# EAGLE design PullDownResistorShield (EAGLE 8.5.1)
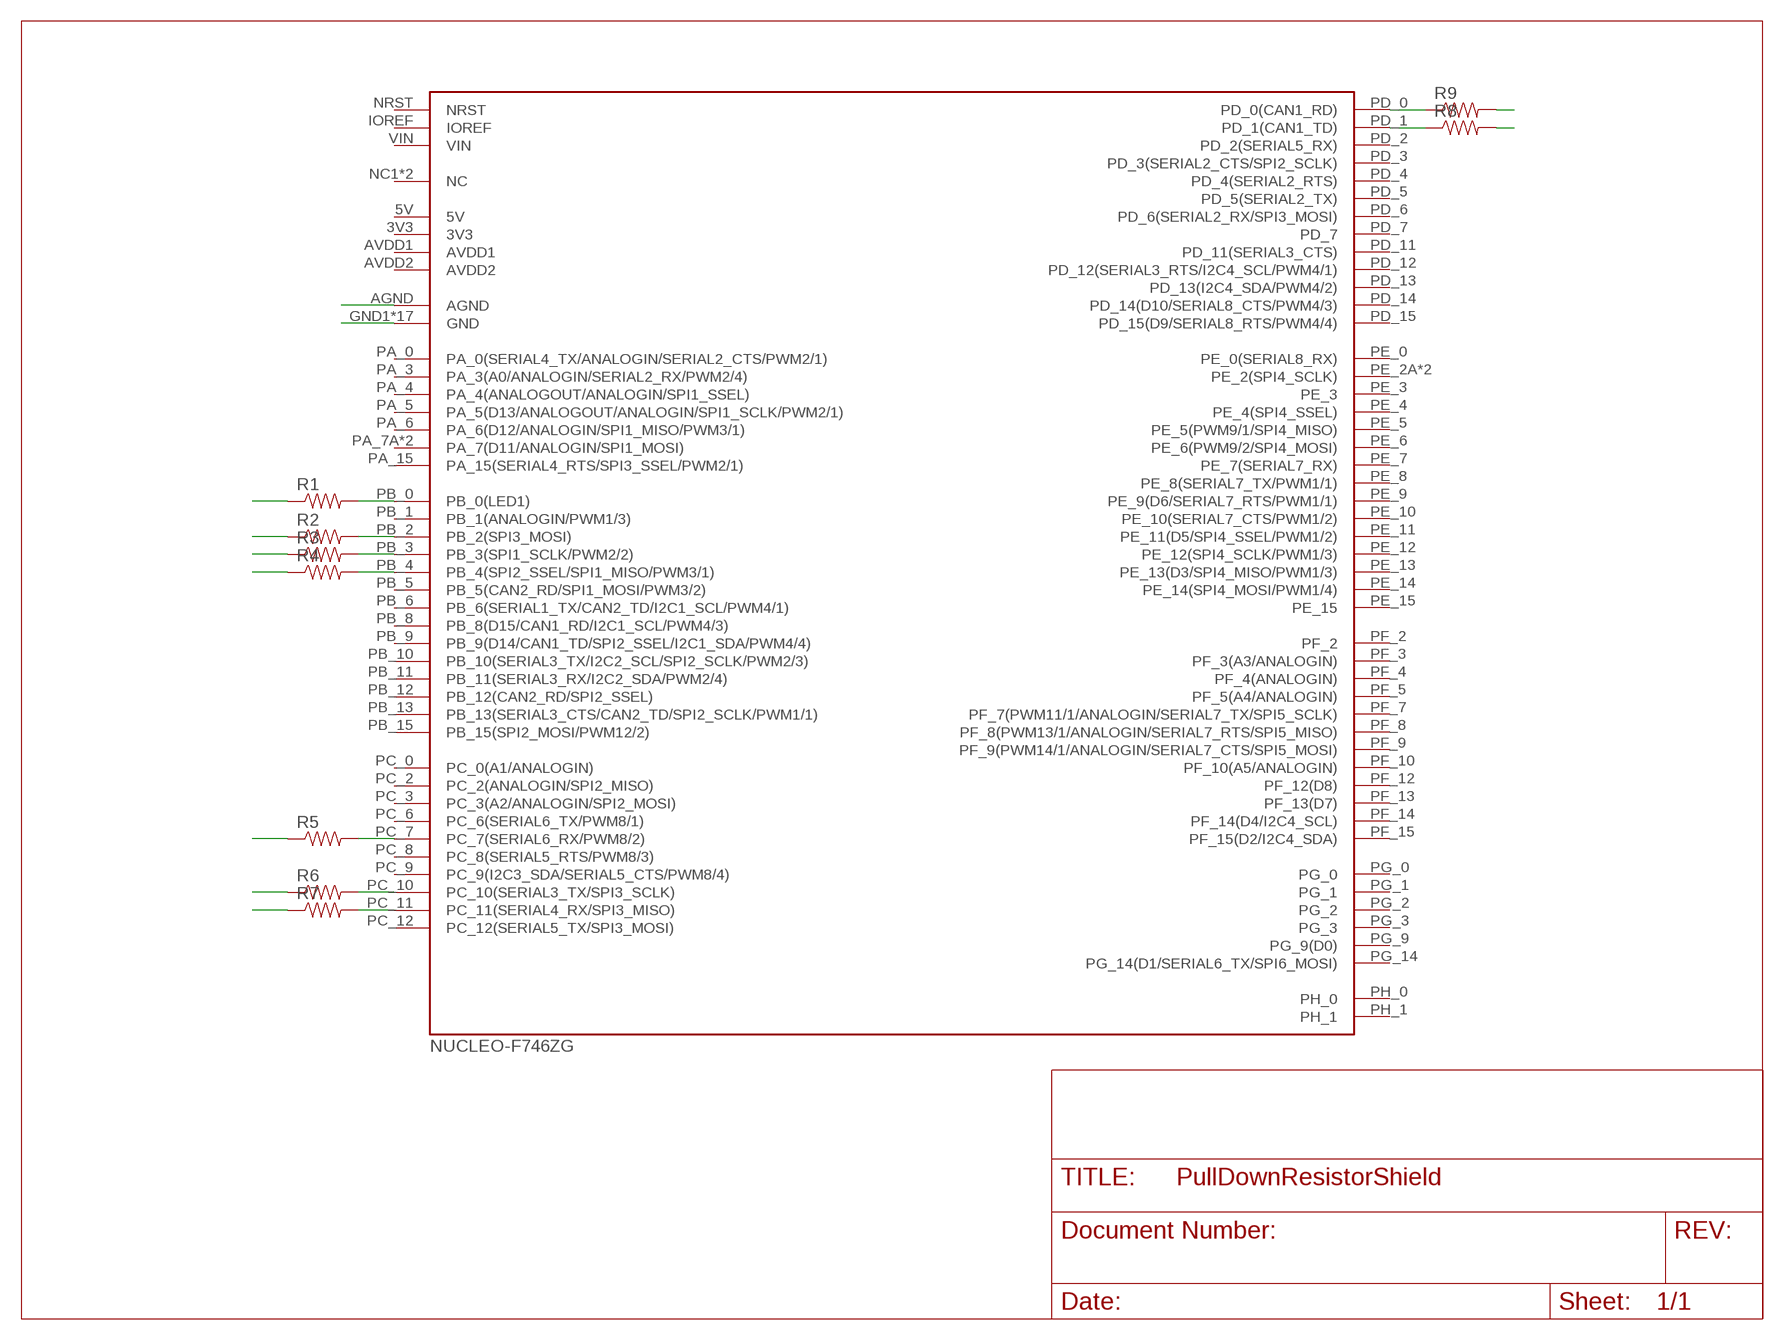
[diagram p0: schematic, sheet 1]

## Parts
R1  RESISTORPTH-1/4W  [AXIAL-0.4]
R2  RESISTORPTH-1/4W  [AXIAL-0.4]
R3  RESISTORPTH-1/4W  [AXIAL-0.4]
R4  RESISTORPTH-1/4W  [AXIAL-0.4]
R5  RESISTORPTH-1/4W  [AXIAL-0.4]
R6  RESISTORPTH-1/4W  [AXIAL-0.4]
R7  RESISTORPTH-1/4W  [AXIAL-0.4]
R8  RESISTORPTH-1/4W  [AXIAL-0.4]
R9  RESISTORPTH-1/4W  [AXIAL-0.4]
U$1  NUCLEO-F746ZGNUCLEO-F746ZG  [NUCLEO-F746ZG]

## Nets
GND: R1.P$1 R2.P$1 R3.P$1 R4.P$1 R5.P$1 R6.P$1 R7.P$1 R8.P$2 R9.P$2 U$1.AGND U$1.GND1(GND) U$1.GND2(GND) U$1.GND3(GND) U$1.GND4(GND) U$1.GND5(GND) U$1.GND6(GND) U$1.GND7(GND) U$1.GND8(GND) U$1.GND9(GND) U$1.GND10(GND) U$1.GND11(GND) U$1.GND12(GND) U$1.GND13(GND) U$1.GND14(GND) U$1.GND15(GND) U$1.GND16(GND) U$1.GND17(GND)
N$1: R1.P$2 U$1.PB_0(PB_0(LED1))
N$2: R2.P$2 U$1.PB_2(PB_2(SPI3_MOSI))
N$3: R3.P$2 U$1.PB_3(PB_3(SPI1_SCLK/PWM2/2))
N$4: R4.P$2 U$1.PB_4(PB_4(SPI2_SSEL/SPI1_MISO/PWM3/1))
N$5: R5.P$2 U$1.PC_7(PC_7(SERIAL6_RX/PWM8/2))
N$6: R6.P$2 U$1.PC_10(PC_10(SERIAL3_TX/SPI3_SCLK))
N$7: R7.P$2 U$1.PC_11(PC_11(SERIAL4_RX/SPI3_MISO))
N$8: R9.P$1 U$1.PD_0(PD_0(CAN1_RD))
N$9: R8.P$1 U$1.PD_1(PD_1(CAN1_TD))
Unconnected: U$1.3V3 U$1.5V U$1.AVDD1 U$1.AVDD2 U$1.IOREF U$1.NC1(NC) U$1.NC2(NC) U$1.NRST U$1.PA_0(PA_0(SERIAL4_TX/ANALOGIN/SERIAL2_CTS/PWM2/1)) U$1.PA_3(PA_3(A0/ANALOGIN/SERIAL2_RX/PWM2/4)) U$1.PA_4(PA_4(ANALOGOUT/ANALOGIN/SPI1_SSEL)) U$1.PA_5(PA_5(D13/ANALOGOUT/ANALOGIN/SPI1_SCLK/PWM2/1)) U$1.PA_6(PA_6(D12/ANALOGIN/SPI1_MISO/PWM3/1)) U$1.PA_7A(PA_7(D11/ANALOGIN/SPI1_MOSI)) U$1.PA_7B(PA_7(D11/ANALOGIN/SPI1_MOSI)) U$1.PA_15(PA_15(SERIAL4_RTS/SPI3_SSEL/PWM2/1)) U$1.PB_1(PB_1(ANALOGIN/PWM1/3)) U$1.PB_5(PB_5(CAN2_RD/SPI1_MOSI/PWM3/2)) U$1.PB_6(PB_6(SERIAL1_TX/CAN2_TD/I2C1_SCL/PWM4/1)) U$1.PB_8(PB_8(D15/CAN1_RD/I2C1_SCL/PWM4/3)) U$1.PB_9(PB_9(D14/CAN1_TD/SPI2_SSEL/I2C1_SDA/PWM4/4)) U$1.PB_10(PB_10(SERIAL3_TX/I2C2_SCL/SPI2_SCLK/PWM2/3)) U$1.PB_11(PB_11(SERIAL3_RX/I2C2_SDA/PWM2/4)) U$1.PB_12(PB_12(CAN2_RD/SPI2_SSEL)) U$1.PB_13(PB_13(SERIAL3_CTS/CAN2_TD/SPI2_SCLK/PWM1/1)) U$1.PB_15(PB_15(SPI2_MOSI/PWM12/2)) U$1.PC_0(PC_0(A1/ANALOGIN)) U$1.PC_2(PC_2(ANALOGIN/SPI2_MISO)) U$1.PC_3(PC_3(A2/ANALOGIN/SPI2_MOSI)) U$1.PC_6(PC_6(SERIAL6_TX/PWM8/1)) U$1.PC_8(PC_8(SERIAL5_RTS/PWM8/3)) U$1.PC_9(PC_9(I2C3_SDA/SERIAL5_CTS/PWM8/4)) U$1.PC_12(PC_12(SERIAL5_TX/SPI3_MOSI)) U$1.PD_2(PD_2(SERIAL5_RX)) U$1.PD_3(PD_3(SERIAL2_CTS/SPI2_SCLK)) U$1.PD_4(PD_4(SERIAL2_RTS)) U$1.PD_5(PD_5(SERIAL2_TX)) U$1.PD_6(PD_6(SERIAL2_RX/SPI3_MOSI)) U$1.PD_7 U$1.PD_11(PD_11(SERIAL3_CTS)) U$1.PD_12(PD_12(SERIAL3_RTS/I2C4_SCL/PWM4/1)) U$1.PD_13(PD_13(I2C4_SDA/PWM4/2)) U$1.PD_14(PD_14(D10/SERIAL8_CTS/PWM4/3)) U$1.PD_15(PD_15(D9/SERIAL8_RTS/PWM4/4)) U$1.PE_0(PE_0(SERIAL8_RX)) U$1.PE_2A(PE_2(SPI4_SCLK)) U$1.PE_2B(PE_2(SPI4_SCLK)) U$1.PE_3 U$1.PE_4(PE_4(SPI4_SSEL)) U$1.PE_5(PE_5(PWM9/1/SPI4_MISO)) U$1.PE_6(PE_6(PWM9/2/SPI4_MOSI)) U$1.PE_7(PE_7(SERIAL7_RX)) U$1.PE_8(PE_8(SERIAL7_TX/PWM1/1)) U$1.PE_9(PE_9(D6/SERIAL7_RTS/PWM1/1)) U$1.PE_10(PE_10(SERIAL7_CTS/PWM1/2)) U$1.PE_11(PE_11(D5/SPI4_SSEL/PWM1/2)) U$1.PE_12(PE_12(SPI4_SCLK/PWM1/3)) U$1.PE_13(PE_13(D3/SPI4_MISO/PWM1/3)) U$1.PE_14(PE_14(SPI4_MOSI/PWM1/4)) U$1.PE_15 U$1.PF_2 U$1.PF_3(PF_3(A3/ANALOGIN)) U$1.PF_4(PF_4(ANALOGIN)) U$1.PF_5(PF_5(A4/ANALOGIN)) U$1.PF_7(PF_7(PWM11/1/ANALOGIN/SERIAL7_TX/SPI5_SCLK)) U$1.PF_8(PF_8(PWM13/1/ANALOGIN/SERIAL7_RTS/SPI5_MISO)) U$1.PF_9(PF_9(PWM14/1/ANALOGIN/SERIAL7_CTS/SPI5_MOSI)) U$1.PF_10(PF_10(A5/ANALOGIN)) U$1.PF_12(PF_12(D8)) U$1.PF_13(PF_13(D7)) U$1.PF_14(PF_14(D4/I2C4_SCL)) U$1.PF_15(PF_15(D2/I2C4_SDA)) U$1.PG_0 U$1.PG_1 U$1.PG_2 U$1.PG_3 U$1.PG_9(PG_9(D0)) U$1.PG_14(PG_14(D1/SERIAL6_TX/SPI6_MOSI)) U$1.PH_0 U$1.PH_1 U$1.VIN

## Library data of the parts
R1-R9 = SparkFun-Passives:RESISTOR: Resistor Basic schematic elements and footprints for 0603, 1206, and PTH resistors.
U$1 = FCC_parts:NUCLEO-F746ZG

## Board
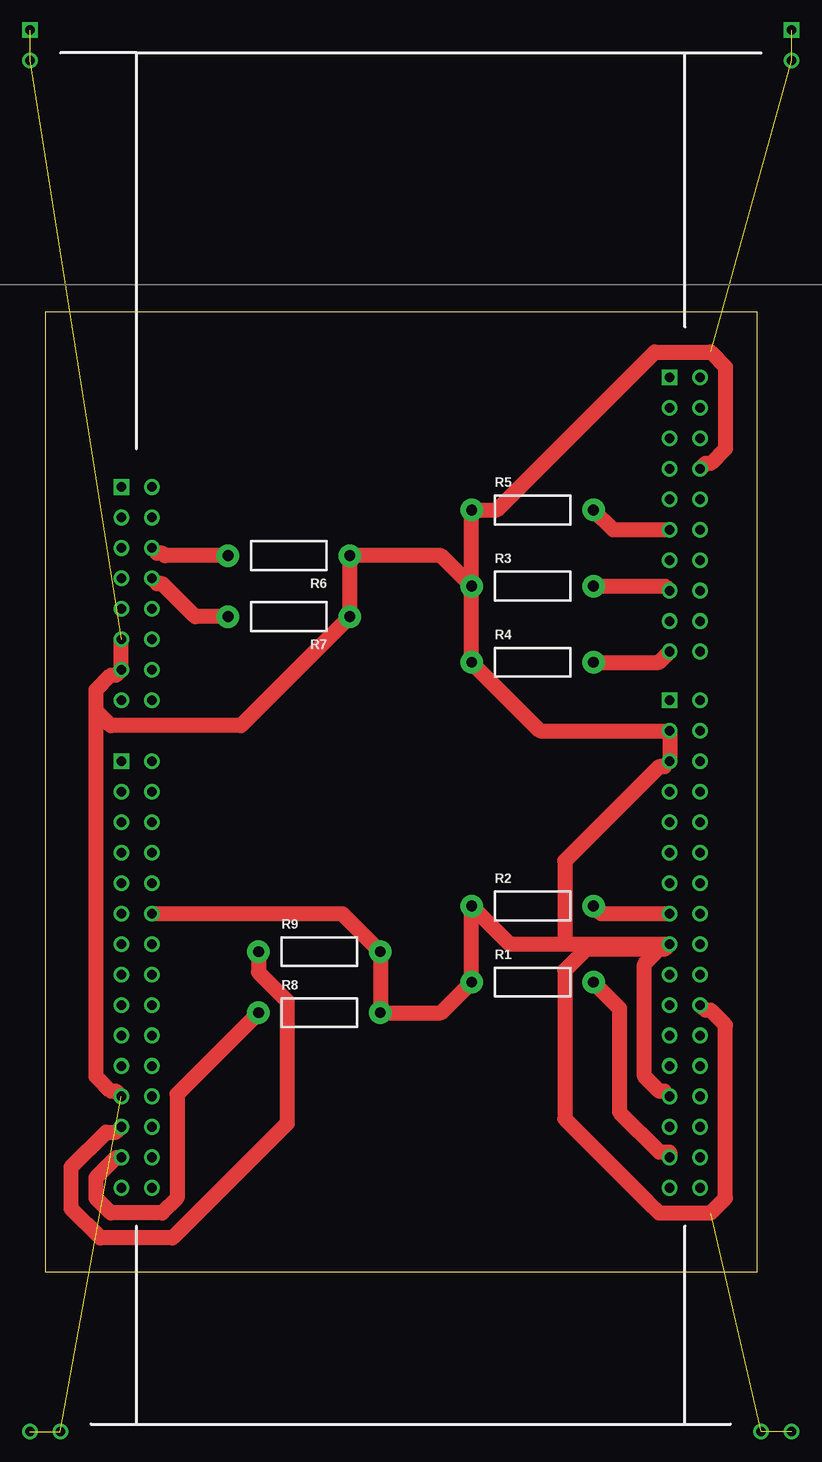
[diagram p1: board, top side]

Size 59.36 x 80 mm. Coordinates in mm from the lower left corner, seen from the top.
Outline: 0,0 59.36,0 59.36,80 0,80 0,0
Copper layers (1*16): Top 0.035mm / dielectric 1.5mm / Bottom 0.035mm
Design rules "default *": minimum track width 6mil, minimum drill 0.35mm, track to track 32mil, track to pad 32mil, pad to pad 32mil, via to via 32mil, smd to smd 32mil, copper to edge 40mil, drill to drill 6mil, minimum pad ring 10mil, minimum via ring 8mil, stop-mask expansion 4mil, vias tented up to drill 0mil, thermal gap 10mil

### Footprints (pad centres in the part's own frame; a part is rotated, then mirrored left to right if it is on the bottom)
AXIAL-0.4 = drill 0.9 pad 1.88: P$1 -5.08,0; P$2 5.08,0
NUCLEO-F746ZG = drill 0.8: 3V3 -24.13,17.151; 5V -24.13,14.611; AGND 21.59,4.451; AVDD1 24.13,28.835; GND1 -24.13,12.071; GND2 -24.13,9.531; GND4 -31.75,60.33; GND6 31.75,60.33; GND7 31.75,-53.969; GND8 29.21,-53.969; GND9 -29.21,-53.969; GND10 -31.75,-53.969; GND11 -24.13,-26.029; GND12 -21.59,-10.789; GND13 24.13,26.295; GND14 21.59,-13.329; GND15 21.59,-26.029; GND16 21.59,1.911; GND17 24.13,-18.409; IOREF -24.13,22.231; NC2 -24.13,-13.329; NRST -24.13,19.691; PA_0 21.59,-28.569; PA_4 21.59,13.595; PA_5 24.13,23.755; PA_6 24.13,21.215; PA_7A -24.13,-15.869; PA_7B 24.13,18.675; PA_15 21.59,23.755; PB_0 21.59,-31.109; PB_1 21.59,-0.629; PB_2 21.59,-10.789; PB_3 21.59,16.135; PB_4 21.59,11.055; PB_5 21.59,18.675; PB_6 21.59,-8.249; PB_8 24.13,33.915; PB_9 24.13,31.375; PB_10 24.13,-31.109; PB_11 24.13,-33.649; PB_12 21.59,26.295; PB_13 21.59,28.835; PB_15 21.59,31.375; PC_0 -24.13,-0.629; PC_2 21.59,-3.169; PC_3 -24.13,-3.169; PC_7 21.59,21.215; PC_8 -21.59,24.771; PC_9 -21.59,22.231; PC_10 -21.59,19.691; PC_11 -21.59,17.151; PC_12 -21.59,14.611; PD_0 -24.13,-28.569; PD_1 -24.13,-31.109; PD_2 -21.59,12.071; PD_3 -21.59,-8.249; PD_4 -21.59,-5.709; PD_5 -21.59,-3.169; PD_6 -21.59,-0.629; PD_7 -21.59,1.911; PD_11 21.59,-20.949; PD_12 21.59,-18.409; PD_13 21.59,-15.869; PD_14 24.13,16.135; PD_15 24.13,13.595; PE_0 21.59,-33.649; PE_2A -21.59,-13.329; PE_2B 21.59,-23.489; PE_3 -21.59,-23.489; PE_4 -21.59,-15.869; PE_5 -21.59,-18.409; PE_6 -21.59,-20.949; PE_7 24.13,-15.869; PE_8 24.13,-13.329; PE_9 24.13,4.451; PE_10 24.13,-20.949; PE_11 24.13,1.911; PE_12 24.13,-23.489; PE_13 24.13,-3.169; PE_14 24.13,-26.029; PE_15 24.13,-28.569; PF_2 -24.13,-18.409; PF_3 -24.13,-5.709; PF_4 21.59,-5.709; PF_5 -24.13,-8.249; PF_7 -21.59,-28.569; PF_8 -21.59,-26.029; PF_9 -21.59,-31.109; PF_10 -24.13,-10.789; PF_12 24.13,11.055; PF_13 24.13,6.991; PF_14 24.13,-0.629; PF_15 24.13,-5.709; PG_0 -24.13,-33.649; PG_1 -21.59,-33.649; PG_2 -21.59,9.531; PG_3 -21.59,6.991; PG_9 24.13,-10.789; PG_14 24.13,-8.249; PH_0 -24.13,-23.489; PH_1 -24.13,-20.949; VIN -24.13,6.991 | drill 0.8 square: AVDD2 21.59,6.991; GND3 -31.75,62.87; GND5 31.75,62.87; NC1 -24.13,24.771; PA_3 -24.13,1.911; PC_6 21.59,33.915

### Placement (x,y rotation side)
R1  40.64,24.13 0 top
R2  40.64,30.48 0 top
R3  40.64,57.15 0 top
R4  40.64,50.8 0 top
R5  40.64,63.5 0 top
R6  20.32,59.69 180 top
R7  20.32,54.61 180 top
R8  22.86,21.59 0 top
R9  22.86,26.67 0 top
U$1  30.48,40.64 0 top

### Tracks (layer width: path | path; a pad name or v marks a point on that pad's centre or on a via)
GND  (8 unrouted)
  Top 1.27: U$1.GND12 24.76,29.85 R9.P$2 R8.P$2 33.02,21.59 R1.P$1 R2.P$1 38.73,27.31 43.18,27.31 | 43.18,27.31 U$1.GND14 51.63,26.87 50.8,26.87 | R3.P$1 R4.P$1 41.27,45.09 U$1.AGND U$1.GND16 51.63,42.11 51.2,42.11 43.33,34.25 43.33,27.46 43.18,27.31 | R3.P$1 R5.P$1 37.66,63.5 50.82,76.66 55.48,76.66 56.71,75.42 56.71,68.6 55.48,67.37 55.05,67.37 U$1.GND13 | R3.P$1 33.02,59.69 R6.P$1 R7.P$1 16.32,45.53 5.48,45.53 4.25,46.76 | U$1.GND1 U$1.GND2 5.91,49.73 5.48,49.73 4.25,48.5 4.25,46.76 | U$1.GND17 55.05,21.79 55.48,21.79 56.71,20.56 56.71,6.12 55.48,4.89 51.2,4.89 50.27,5.82 43.33,12.76 43.33,25.12 45.09,26.87 50.8,26.87 | U$1.GND15 51.63,15.05 51.2,15.05 49.97,16.28 49.97,25.64 50.8,26.47 50.8,26.87 | U$1.GND11 5.91,15.05 5.48,15.05 4.25,16.28 4.25,46.76 | 4.25,46.76
N$1
  Top 1.27: R1.P$2 47.88,21.96 47.88,13.28 51.2,9.97 52.07,9.97 U$1.PB_0
N$2
  Top 1.27: R2.P$2 46.35,29.85 U$1.PB_2
N$3
  Top 1.27: R3.P$2 51.7,57.15 U$1.PB_3
N$4
  Top 1.27: R4.P$2 51.17,50.8 U$1.PB_4
N$5
  Top 1.27: R5.P$2 47.37,61.85 U$1.PC_7
N$6
  Top 1.27: R6.P$2 9.96,59.69 9.76,59.89 9.33,59.89 U$1.PC_10
N$7
  Top 1.27: U$1.PC_11 9.33,57.35 9.76,57.35 12.5,54.61 R7.P$2
N$8
  Top 1.27: R9.P$1 17.78,24.97 20.17,22.58 20.17,12.35 10.62,2.81 4.62,2.81 2.17,5.26 2.17,8.72 5.07,11.63 5.91,11.63 U$1.PD_0
N$9
  Top 1.27: R8.P$1 10.99,14.8 10.99,6.12 9.76,4.89 5.48,4.89 4.25,6.12 4.25,7.86 5.92,9.53 U$1.PD_1